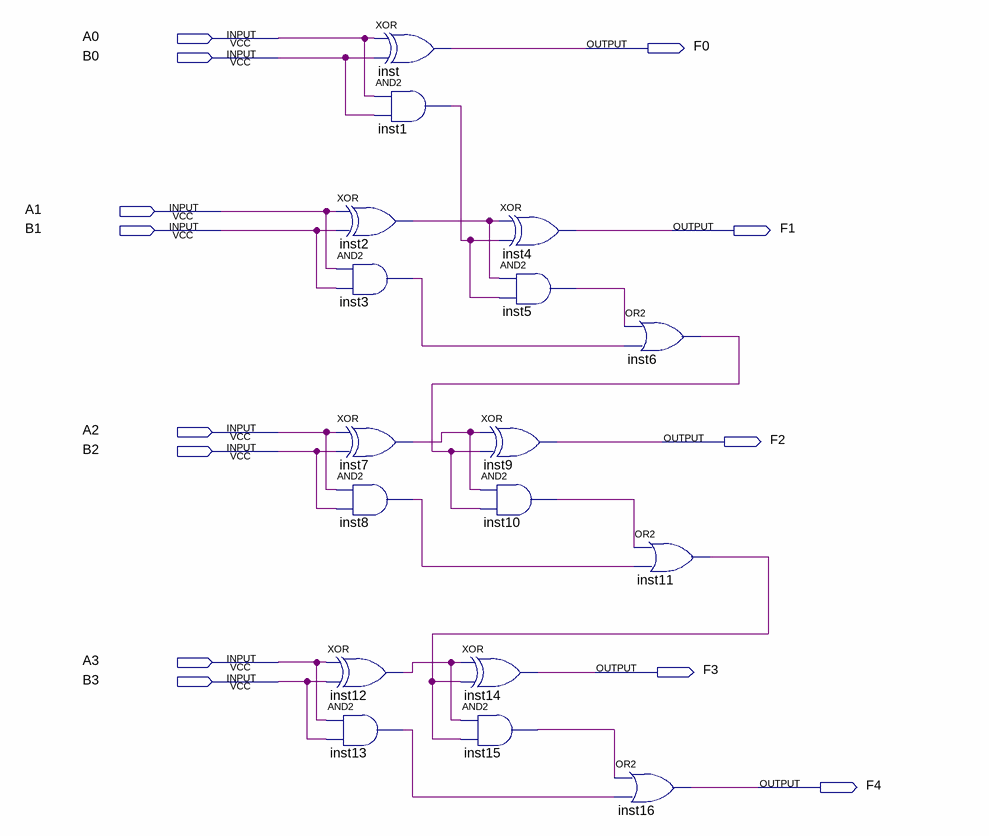
[diagram p0: schematic sheet]
// Quartus schematic L4bit_add.bdf as structural Verilog: 17 symbols, 13 pins
module L4bit_add (
  input  A0,
  input  B0,
  input  A1,
  input  B1,
  input  A2,
  input  B2,
  input  A3,
  input  B3,
  output F0,
  output F1,
  output F2,
  output F3,
  output F4
);

  wire inst1_out, inst2_out, inst3_out, inst5_out, inst6_out, inst7_out, inst8_out, inst10_out, inst11_out,
       inst12_out, inst13_out, inst15_out;

  xor inst (F0, A0, B0);
  and inst1 (inst1_out, A0, B0);
  xor inst2 (inst2_out, A1, B1);
  and inst3 (inst3_out, A1, B1);
  xor inst7 (inst7_out, A2, B2);
  and inst8 (inst8_out, A2, B2);
  xor inst12 (inst12_out, A3, B3);
  and inst13 (inst13_out, A3, B3);
  xor inst14 (F3, inst12_out, inst11_out);
  and inst15 (inst15_out, inst12_out, inst11_out);
  xor inst4 (F1, inst2_out, inst1_out);
  and inst5 (inst5_out, inst2_out, inst1_out);
  xor inst9 (F2, inst7_out, inst6_out);
  and inst10 (inst10_out, inst7_out, inst6_out);
  or inst16 (F4, inst15_out, inst13_out);
  or inst6 (inst6_out, inst5_out, inst3_out);
  or inst11 (inst11_out, inst10_out, inst8_out);
endmodule
